# Altium schematic sheet lpc_telem.SchDoc
size A4
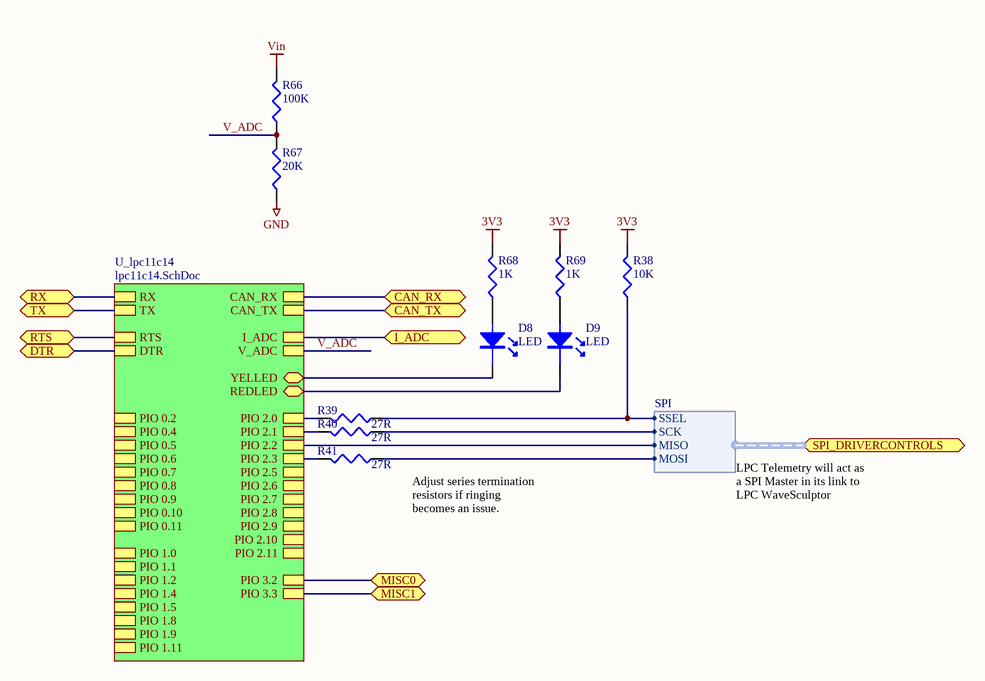
[diagram p0: lpc_telem.SchDoc]

## Parts
D8  LED  [0805LED]
D9  LED  [0805LED]
R38  10K  [0603]
R39  27R  [0603]
R40  27R  [0603]
R41  27R  [0603]
R66  100K  [0603]
R67  20K  [0603]
R68  1K  [0603]
R69  1K  [0603]

## Sub-sheets
U_lpc11c14 = lpc11c14.SchDoc: TX, RX, CAN_RX, CAN_TX, RTS, DTR, YELLED (bidir), REDLED (bidir), I_ADC, V_ADC, PIO 2.1, PIO 2.5, PIO 2.9, PIO 2.10, PIO 2.2, PIO 0.8, PIO 0.9, PIO 0.10, PIO 2.11, PIO 0.11, PIO 1.0, PIO 1.1, PIO 1.2, PIO 2.3, PIO 1.4, PIO 3.2, PIO 1.5, PIO 3.3, PIO 0.2, PIO 0.4, PIO 0.5, PIO 0.6, PIO 0.7, PIO 2.6, PIO 2.0, PIO 2.7, PIO 2.8, PIO 1.8, PIO 1.9, PIO 1.11

## Ports
CAN_RX, CAN_TX, DTR, I_ADC, MISC0, MISC1, RTS, RX, SPI_DRIVERCONTROLS (harness SPI), TX

## Harnesses
SPI: SSEL, SCK, MOSI, MISO

## Nets
3V3: R38.2 R68.2 R69.2
GND: R67.1
Vin: R66.2
CAN_RX: port CAN_RX, sheet U_lpc11c14/CAN_RX
CAN_TX: port CAN_TX, sheet U_lpc11c14/CAN_TX
DTR: port DTR, sheet U_lpc11c14/DTR
I_ADC: port I_ADC, sheet U_lpc11c14/I_ADC
MISC0: port MISC0, sheet U_lpc11c14/PIO 3.2
MISC1: port MISC1, sheet U_lpc11c14/PIO 3.3
RTS: port RTS, sheet U_lpc11c14/RTS
RX: port RX, sheet U_lpc11c14/RX
TX: port TX, sheet U_lpc11c14/TX
V_ADC: R66.1 R67.2 ; sheet U_lpc11c14/V_ADC
NetD8_A: D8.A R68.1
NetD8_K: D8.K ; sheet U_lpc11c14/YELLED
NetD9_A: D9.A R69.1
NetD9_K: D9.K ; sheet U_lpc11c14/REDLED
NetR38_1: R38.1 R39.1 ; port SPI_DRIVERCONTROLS.SSEL
NetR39_2: R39.2 ; sheet U_lpc11c14/PIO 2.0
NetR40_1: R40.1 ; port SPI_DRIVERCONTROLS.SCK
NetR40_2: R40.2 ; sheet U_lpc11c14/PIO 2.1
NetR41_1: R41.1 ; port SPI_DRIVERCONTROLS.MOSI
NetR41_2: R41.2 ; sheet U_lpc11c14/PIO 2.3
(unnamed): sheet U_lpc11c14/PIO 2.2, port SPI_DRIVERCONTROLS.MISO

## Notes on the sheet
- Adjust series termination resistors if ringing becomes an issue.
- LPC Telemetry will act as a SPI Master in its link to LPC WaveSculptor

## Library data of the parts
D8 = LED: Manufacturer: OSRAM Opto Semiconductors Inc; Manufacturer Part Number: LY R976-PS-36; Description: LED CHIPLED 588NM YLW 0805 SMD; Color: Yellow; Millicandela Rating: 162.5mcd; Voltage - Forward (Vf) Typ: 2V; Current - Test: 20mA; Wavelength - Dominant: 588nm; Wavelength - Peak: 591nm; Viewing Angle: 160°; Lens Type: Diffused; Lens Style/Size: Rectangle with Flat Top, 1.3mm x 1.25mm; Luminous Flux @ Current - Test: 520 mlm; Supplier 1: Digi-Key; Supplier Part Number 1: 475-2560-1-ND; RoHS: RoHS Compliant; Category: Optoelectronics; Stock 1: 42136; Pricing 1: 1=0.14, 10=0.112, 100=0.0892, 250=0.07804, 500=0.07132 (AUD); Packaging: Cut Tape (CT); Package / Case: 0805 (2012 Metric); Size / Dimension: 2.00mm L x 1.25mm W; Height: 0.80mm; Mounting Type: Surface Mount; ComponentLink1URL: http://catalog.osram-os.com/jsp/download.jsp?name=LO_LS_LY_R976.pdf&url=/media/_en/Graphics/00042116_0.pdf; ComponentLink1Description: http://catalog.osram-os.com/jsp/download.jsp?name=LO_LS_LY_R976.pdf&url=/media/_en/Graphics/00042116_0.pdf
D9 = LED: Manufacturer: OSRAM Opto Semiconductors Inc; Manufacturer Part Number: LS R976-NR-1; Description: LED CHIPLED 633NM RED 0805 SMD; Color: Red; Millicandela Rating: 104mcd; Voltage - Forward (Vf) Typ: 2V; Current - Test: 20mA; Wavelength - Dominant: 633nm; Wavelength - Peak: 645nm; Viewing Angle: 160°; Lens Type: Diffused; Lens Style/Size: Rectangle with Flat Top, 1.3mm x 1.25mm; Luminous Flux @ Current - Test: 330 mlm; Supplier 1: Digi-Key; Supplier Part Number 1: 475-1278-1-ND; RoHS: RoHS Compliant; Category: Optoelectronics; Stock 1: 53912; Pricing 1: 1=0.14, 10=0.112, 100=0.0892, 250=0.07804, 500=0.07132 (AUD); Packaging: Cut Tape (CT); Package / Case: 0805 (2012 Metric); Size / Dimension: 2.00mm L x 1.25mm W; Height: 0.80mm; Mounting Type: Surface Mount; ComponentLink1URL: http://catalog.osram-os.com/jsp/download.jsp?name=LO_LS_LY_R976.pdf&url=/media/_en/Graphics/00042116_0.pdf; ComponentLink1Description: http://catalog.osram-os.com/jsp/download.jsp?name=LO_LS_LY_R976.pdf&url=/media/_en/Graphics/00042116_0.pdf
R38 R68 R69 = RES1: Resistor
R39-R41 = RES1: Resistor; Manufacturer: Panasonic Electronic Components; Manufacturer Part Number: ERJ-3EKF27R0V; Description: RES 27 OHM 1/10W 1% 0603 SMD; Resistance (Ohms): 27; Power (Watts): 0.1W, 1/10W; Temperature Coefficient: ±100ppm/°C; Tolerance: ±1%; Supplier 1: Digi-Key; Supplier Part Number 1: P27.0HCT-ND; RoHS: RoHS Compliant; Category: Resistors; Stock 1: 89523; Pricing 1: 1=0.12, 50=0.0166, 100=0.0126, 250=0.00936, 500=0.00692, 1000=0.00461 (AUD); Packaging: Cut Tape (CT); Composition: Thick Film; Features: -; Package / Case: 0603 (1608 Metric); Supplier Device Package: 0603; Size / Dimension: 0.063" L x 0.031" W (1.60mm x 0.80mm); Height: 0.022" (0.55mm); Number of Terminations: 2; ComponentLink1URL: http://industrial.panasonic.com/www-cgi/jvcr13pz.cgi?E+PZ+3+AOA0002+ERJ3EKF27R0V+7+WW; ComponentLink1Description: http://industrial.panasonic.com/www-cgi/jvcr13pz.cgi?E+PZ+3+AOA0002+ERJ3EKF27R0V+7+WW
R66 = RES1: Resistor; Manufacturer: Panasonic Electronic Components; Manufacturer Part Number: ERJ-3EKF1003V; Needed?: NO - HW LAB; Description: RES 100K OHM 1/10W 1% 0603 SMD; Power (Watts): 0.1W, 1/10W; Temperature Coefficient: ±100ppm/°C; Tolerance: ±1%; Value: 100k; Supplier 1: Digi-Key; Supplier Part Number 1: P100KHCT-ND; RoHS: RoHS Compliant; Category: Resistors; Stock 1: 8186012; Pricing 1: 1=0.12, 50=0.0166, 100=0.0126, 250=0.00936, 500=0.00692, 1000=0.00461 (AUD); Packaging: Cut Tape (CT); Resistance (Ohms): 100k; Composition: Thick Film; Features: -; Package / Case: 0603 (1608 Metric); Supplier Device Package: 0603; Size / Dimension: 0.063" L x 0.031" W (1.60mm x 0.80mm); Height: 0.022" (0.55mm); Number of Terminations: 2; ComponentLink1URL: http://industrial.panasonic.com/www-cgi/jvcr13pz.cgi?E+PZ+3+AOA0002+ERJ3EKF1003V+7+WW; ComponentLink1Description: http://industrial.panasonic.com/www-cgi/jvcr13pz.cgi?E+PZ+3+AOA0002+ERJ3EKF1003V+7+WW
R67 = RES1: Resistor; Manufacturer: Panasonic Electronic Components; Manufacturer Part Number: ERJ-3EKF2002V; Needed?: NO - HW LAB; Description: RES 20K OHM 1/10W 1% 0603 SMD; Power (Watts): 0.1W, 1/10W; Temperature Coefficient: ±100ppm/°C; Tolerance: ±1%; Value: 20k; Supplier 1: Digi-Key; Supplier Part Number 1: P20.0KHCT-ND; RoHS: RoHS Compliant; Category: Resistors; Stock 1: 1656647; Pricing 1: 1=0.12, 50=0.0166, 100=0.0126, 250=0.00936, 500=0.00692, 1000=0.00461 (AUD); Packaging: Cut Tape (CT); Resistance (Ohms): 20k; Composition: Thick Film; Features: -; Package / Case: 0603 (1608 Metric); Supplier Device Package: 0603; Size / Dimension: 0.063" L x 0.031" W (1.60mm x 0.80mm); Height: 0.022" (0.55mm); Number of Terminations: 2; ComponentLink1URL: http://industrial.panasonic.com/www-cgi/jvcr13pz.cgi?E+PZ+3+AOA0002+ERJ3EKF2002V+7+WW; ComponentLink1Description: http://industrial.panasonic.com/www-cgi/jvcr13pz.cgi?E+PZ+3+AOA0002+ERJ3EKF2002V+7+WW